# Altium schematic sheet STM32F103RCT6.SchDoc
size 274 x 203 mm; SheetNumber: 3; SheetTotal: 4
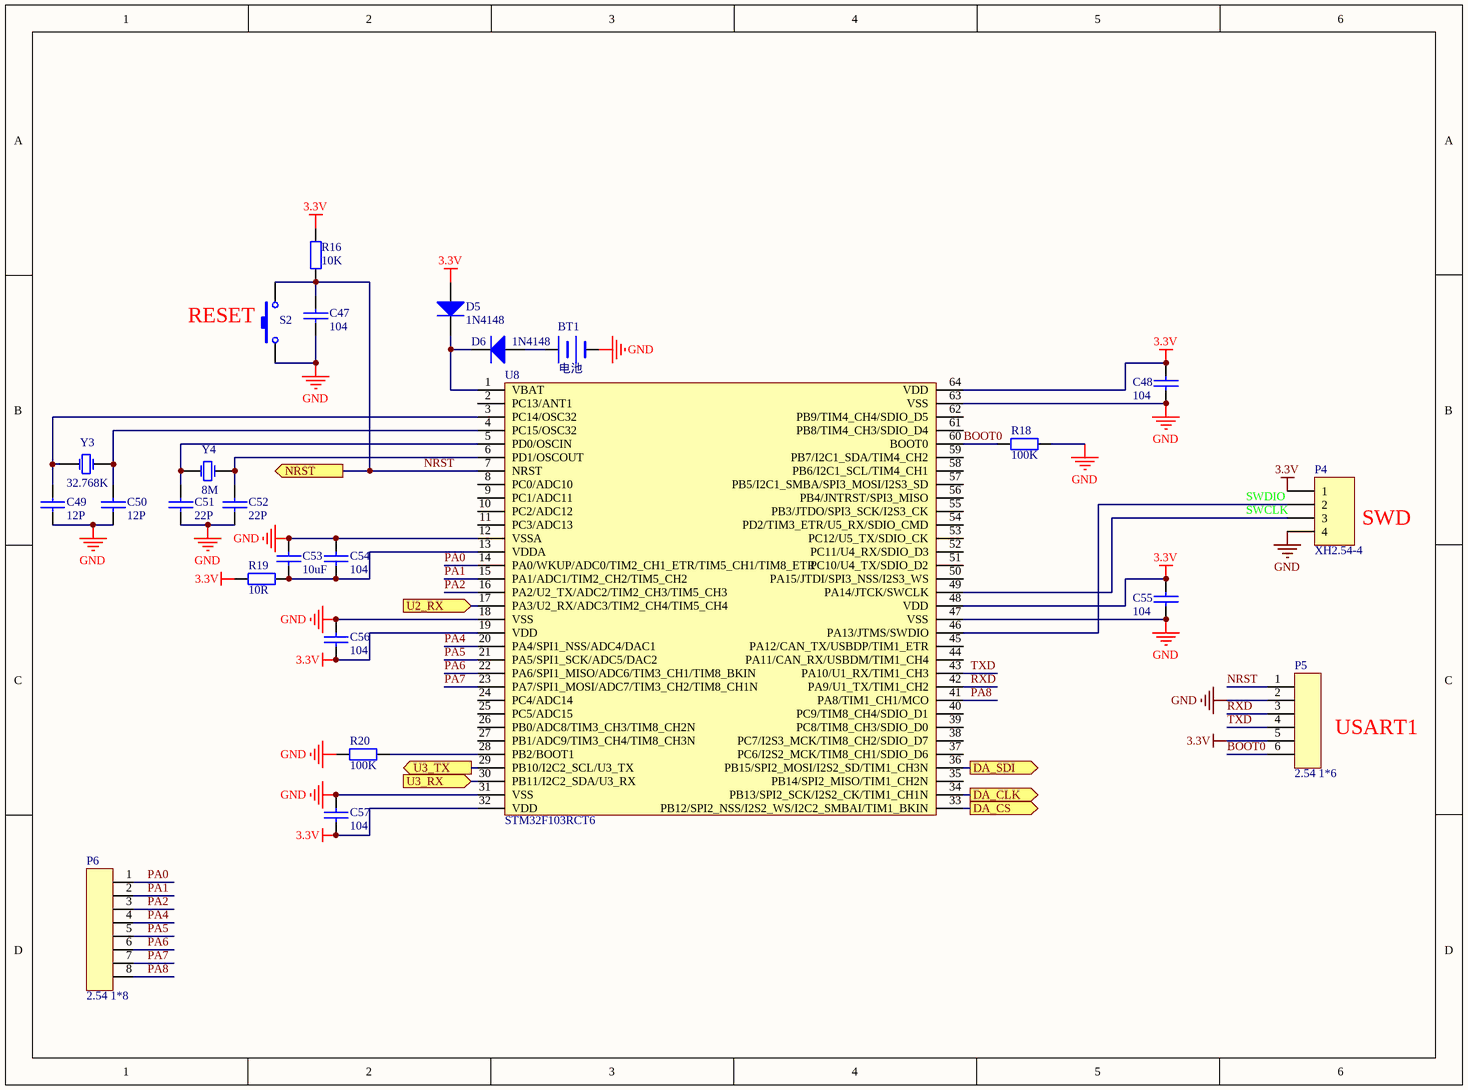
[diagram p0: STM32F103RCT6.SchDoc]

## Parts
BT1  电池  [BAT-3V]
C47  104  [0805]
C48  104  [0805]
C49  12P  [0805]
C50  12P  [0805]
C51  22P  [0805]
C52  22P  [0805]
C53  10uF  [1206]
C54  104  [0805]
C55  104  [0805]
C56  104  [0805]
C57  104  [0805]
D5  1N4148  [二极管 贴片 IN4148]
D6  1N4148  [二极管 贴片 IN4148]
P4  XH2.54-4  [VH2.54_4]
P5  2.54 1*6  [单排插针 2.54 1*6]
P6  2.54 1*8  [单排插针 2.54 1*8]
R16  10K  [0805]
R18  100K  [0805]
R19  10R  [0805]
R20  100K  [0805]
S2  key  [按键 轻触  6*3]  (value not drawn)
U8  STM32F103RCT6  [LQFP64]
Y3  32.768K  [晶振 卧 BCY-W2/D3.1]
Y4  8M  [晶振 BCY-W2/E4.7]

## Ports
DA_CLK (out), DA_CS (out), DA_SDI (out), NRST (out), U2_RX (in), U3_RX (in), U3_TX (out)

## Nets
3.3V: C48.1 C55.1 C56.1 C57.1 D5.1(A) P4.1 P5.5 R16.1 R19.1 U8.19(VDD) U8.32(VDD) U8.48(VDD) U8.64(VDD)
GND: BT1.2(-) C47.1 C48.2 C49.1 C50.1 C51.1 C52.1 C53.2 C54.2 C55.2 C56.2 C57.2 P4.4 P5.2 R18.1 R20.1 S2.1 U8.12(VSSA) U8.18(VSS) U8.31(VSS) U8.47(VSS) U8.63(VSS)
BOOT0: P5.6 R18.2 U8.60(BOOT0)
DA_CLK: U8.34(PB13/SPI2_SCK/I2S2_CK/TIM1_CH1N) ; port DA_CLK
DA_CS: U8.33(PB12/SPI2_NSS/I2S2_WS/I2C2_SMBAI/TIM1_BKIN) ; port DA_CS
DA_SDI: U8.36(PB15/SPI2_MOSI/I2S2_SD/TIM1_CH3N) ; port DA_SDI
NRST: C47.2 P5.1 R16.2 S2.2 U8.7(NRST) ; port NRST
PA0: P6.1 U8.14(PA0/WKUP/ADC0/TIM2_CH1_ETR/TIM5_CH1/TIM8_ETR)
PA1: P6.2 U8.15(PA1/ADC1/TIM2_CH2/TIM5_CH2)
PA2: P6.3 U8.16(PA2/U2_TX/ADC2/TIM2_CH3/TIM5_CH3)
PA4: P6.4 U8.20(PA4/SPI1_NSS/ADC4/DAC1)
PA5: P6.5 U8.21(PA5/SPI1_SCK/ADC5/DAC2)
PA6: P6.6 U8.22(PA6/SPI1_MISO/ADC6/TIM3_CH1/TIM8_BKIN)
PA7: P6.7 U8.23(PA7/SPI1_MOSI/ADC7/TIM3_CH2/TIM8_CH1N)
PA8: P6.8 U8.41(PA8/TIM1_CH1/MCO)
RXD: P5.3 U8.42(PA9/U1_TX/TIM1_CH2)
SWCLK: P4.3 U8.49(PA14/JTCK/SWCLK)
SWDIO: P4.2 U8.46(PA13/JTMS/SWDIO)
TXD: P5.4 U8.43(PA10/U1_RX/TIM1_CH3)
U2_RX: U8.17(PA3/U2_RX/ADC3/TIM2_CH4/TIM5_CH4) ; port U2_RX
U3_RX: U8.30(PB11/I2C2_SDA/U3_RX) ; port U3_RX
U3_TX: U8.29(PB10/I2C2_SCL/U3_TX) ; port U3_TX
NetBT1_1: BT1.1(+) D6.1(A)
NetC49_2: C49.2 U8.3(PC14/OSC32) Y3.1(OSC1)
NetC50_2: C50.2 U8.4(PC15/OSC32) Y3.2(OSC2)
NetC51_2: C51.2 U8.5(PD0/OSCIN) Y4.2(OSC2)
NetC52_2: C52.2 U8.6(PD1/OSCOUT) Y4.1(OSC1)
NetC53_1: C53.1 C54.1 R19.2 U8.13(VDDA)
NetD5_2: D5.2(K) D6.2(K) U8.1(VBAT)
NetR20_2: R20.2 U8.28(PB2/BOOT1)

Not connected (* = marked no-connect by the designer): U8 2(PC13/ANT1) 8(PC0/ADC10) 9(PC1/ADC11) 10(PC2/ADC12) 11(PC3/ADC13) 24(PC4/ADC14) 25(PC5/ADC15) 26(PB0/ADC8/TIM3_CH3/TIM8_CH2N) 27(PB1/ADC9/TIM3_CH4/TIM8_CH3N) 35(PB14/SPI2_MISO/TIM1_CH2N) 37(PC6/I2S2_MCK/TIM8_CH1/SDIO_D6) 38(PC7/I2S3_MCK/TIM8_CH2/SDIO_D7) 39(PC8/TIM8_CH3/SDIO_D0) 40(PC9/TIM8_CH4/SDIO_D1) 44(PA11/CAN_RX/USBDM/TIM1_CH4) 45(PA12/CAN_TX/USBDP/TIM1_ETR) 50(PA15/JTDI/SPI3_NSS/I2S3_WS) 51(PC10/U4_TX/SDIO_D2) 52(PC11/U4_RX/SDIO_D3) 53(PC12/U5_TX/SDIO_CK) 54(PD2/TIM3_ETR/U5_RX/SDIO_CMD) 55(PB3/JTDO/SPI3_SCK/I2S3_CK) 56(PB4/JNTRST/SPI3_MISO) 57(PB5/I2C1_SMBA/SPI3_MOSI/I2S3_SD) 58(PB6/I2C1_SCL/TIM4_CH1) 59(PB7/I2C1_SDA/TIM4_CH2) 61(PB8/TIM4_CH3/SDIO_D4) 62(PB9/TIM4_CH4/SDIO_D5)

## Notes on the sheet
- (near S2) RESET
- (near P4) SWD
- (near P5) USART1

## Library data of the parts
BT1 = 电池座 大
C47-C57 = 贴片电容 0805: 名称: 贴片电容; 封装: 0603; 单位: 个
D5 D6 = 二极管 贴片 1N4148: 名称: 贴片二极管; 封装: 1206; 单位: 个
P4 = 联结件 XH2.54-4: 名称: 联结件; 单位: 套; 封装: XH2.54-4
P5 = 联结件 单排插针 2.54 1*6: 单位: 片; 封装: DIP; 名称: 单排插针
P6 = 联结件 单排插针 2.54 1*8: 单位: 片; 封装: DIP; 名称: 单排插针
R16 R19 = 贴片电阻 0603: 名称: 贴片电阻; 封装: 0603; 单位: 个
R18 R20 = 贴片电阻 0805: 名称: 贴片电阻; 单位: 个; 封装: 0805
S2 = 按键 轻触 3*6: 单位: 个; 名称: 开关; 封装: 直插 12*12*12
U8 = 贴片芯片 STM32F103RCT6: 名称: 芯片; 单位: 片; 封装: LQFP64
Y3 Y4 = 晶振 直插矮: 名称: 晶振; 封装: 直插矮; 单位: 个